# EasyEDA Pro project tumkibot1_audio_amplifier.eprj

# Schematic Schematic1
Board Name: Board1; Create Date: 2025-09-22; Page Name: P1; Project Name: tumkibot1_audio_amplifier; Schematic Name: Schematic1; Update Date: 2025-09-22; Company: EasyEDA.com; Page Size: A4; Version: V1.0
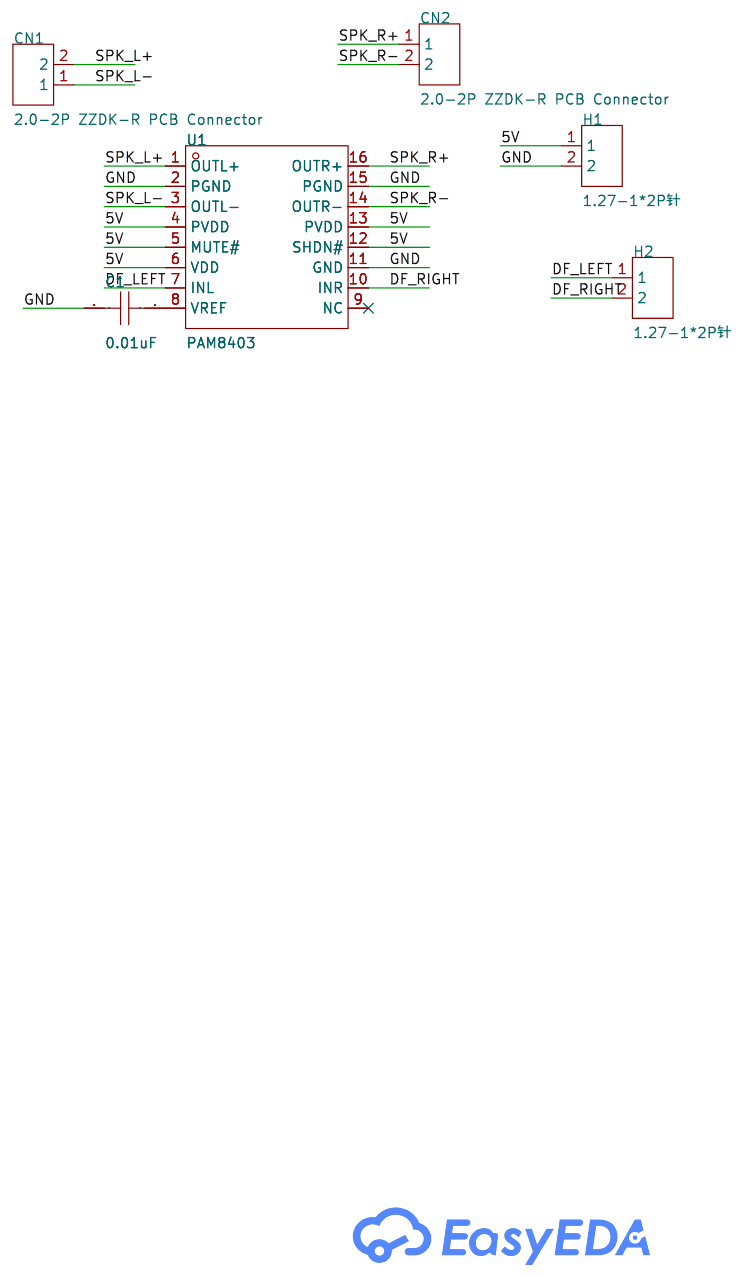
[diagram p0: schematic sheet]

## Parts
C1  100nF  [C0603]
CN1  2.0-2P ZZDK-R PCB Connector  [CONN-TH_2.0-2P-ZZDK-R-PCB-CONNECTOR]
CN2  2.0-2P ZZDK-R PCB Connector  [CONN-TH_2.0-2P-ZZDK-R-PCB-CONNECTOR]
H1  1.27-1*2P针  [HDR-TH_2P-P1.27-V-M]
H2  1.27-1*2P针  [HDR-TH_2P-P1.27-V-M]
U1  PAM8403  [SOP-16_L10.0-W3.9-P1.27-LS6.0-BL]

## Library data of the parts
C1 = CAP_0603: Supplier Footprint: 0603
CN1 CN2 = 2.0-2P ZZDK-R PCB Connector: LCSC Part Name: 1x2P 间距：2.0mm; Supplier Part: C49023773; Manufacturer: SHOU HAN(首韩); Supplier Footprint: 插件,P=2mm; JLCPCB Part Class: Extended Part; Datasheet: https://item.szlcsc.com/datasheet/2.0-2P%2520ZZDK-R%2520PCB%2520Connector/51384148.html; Supplier: LCSC
H1 H2 = 1.27-1*2P针: LCSC Part Name: 1x2P 间距:1.27mm 方针 直插; Supplier Part: C703015; Manufacturer: BOOMELE(博穆精密); Supplier Footprint: 插件,P=1.27mm; JLCPCB Part Class: Extended Part; Datasheet: https://item.szlcsc.com/datasheet/1.27-1*2P%25E9%2592%2588/738187.html; Supplier: LCSC; Pin Structure: 1x2P; Pitch: 1.27mm; Circluar Pins/Square Pins: Pin Header; Mounting Type: Through Hole; Number of Rows: 1; Number of Pins: 2P; Current Rating: 3A; Length of Mating Pin: 3mm; Insulation Height: 1.7mm; Length of End Connection Pin: 2.5mm; Contact Material: Brass; Operating Temperature: -55℃~+105℃; Color: Black
U1 = PAM8403: Supplier Part: C5122557; Manufacturer: Slkor(萨科微); Supplier Footprint: SOP-16; JLCPCB Part Class: Extended Part; Datasheet: https://item.szlcsc.com/datasheet/PAM8403/5713463.html; Supplier: LCSC; Class: Class D; Voltage - Supply: 2.2V~5.5V

## Nets
5V: H1.1 U1.4(PVDD) U1.5(MUTE#) U1.6(VDD) U1.12(SHDN#) U1.13(PVDD)
GND: C1.2 H1.2 U1.2(PGND) U1.11(GND) U1.15(PGND)
DF_LEFT: H2.1 U1.7(INL)
DF_RIGHT: H2.2 U1.10(INR)
SPK_L+: CN1.2 U1.1(OUTL+)
SPK_L-: CN1.1 U1.3(OUTL-)
SPK_R+: CN2.1 U1.16(OUTR+)
SPK_R-: CN2.2 U1.14(OUTR-)
$1N368: C1.1 U1.8(VREF)

Not connected (* = marked no-connect by the designer): U1 9(NC)*

# Board PCB1
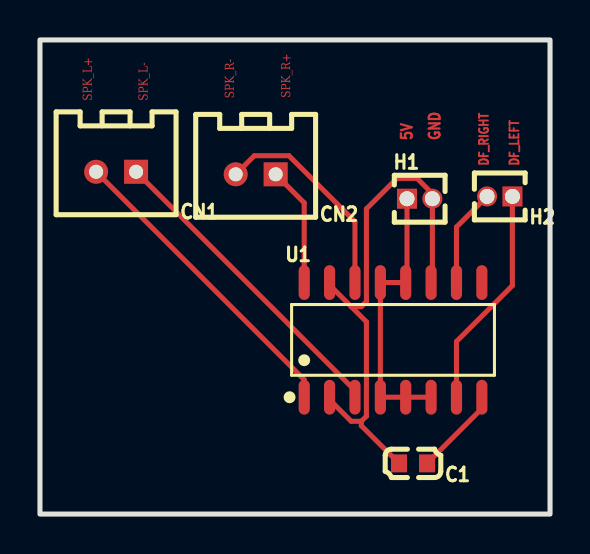
[diagram p1: board, top side]
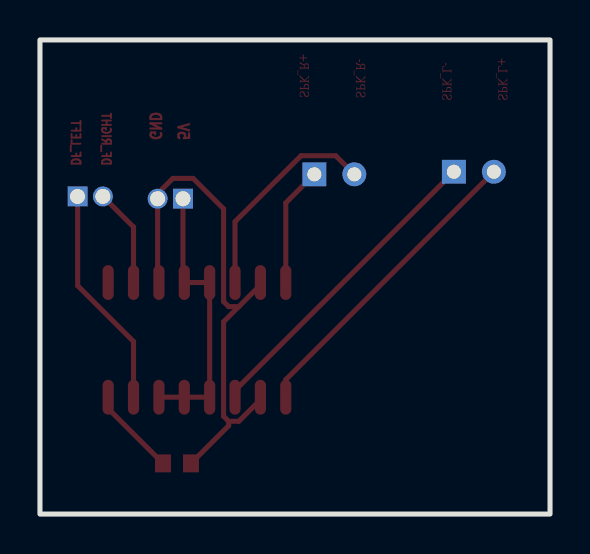
[diagram p2: board, bottom side, seen from below]

Outline 25.53 x 23.75 mm; copper layers: Top Layer, Bottom Layer. Coordinates in mm from the lower left corner of the outline.
Outline path: rectangle 0,23.75 25.53,0
Stack: Top Layer 0.035mm / Dielectric1 1.51mm FR4 er 4.5 / Bottom Layer 0.035mm

## Design rules (mm)
template: JLCPCB Capability(Two Layers Board)
spacing copperThickness1oz (default): track to track 0.102, other pairs 0.152 to 0.3
spacing copperThickness2oz: track to track 0.203, other pairs 0.152 to 0.3
track width copperThickness1oz (default): min 0.127, default 0.254, max 2.54
track width copperThickness2oz: min 0.203, default 0.254, max 2.54
differential pair differentialPair (default): width min 0.127, default 0.254, max 2.54; gap min 0.152, default 0.152
via viaSize (default): diameter min 0.5, default 0.61, max 10; hole min 0.3, default 0.305, max 6.3

## Placement (name value [footprint] x y rotation side)
C1  100nF  [C0603]  18.67 2.54 180 top
CN1  2.0-2P ZZDK-R PCB Connector  [CONN-TH_2.0-2P-ZZDK-R-PCB-CONNECTOR]  3.81 17.14 180 top
CN2  2.0-2P ZZDK-R PCB Connector  [CONN-TH_2.0-2P-ZZDK-R-PCB-CONNECTOR]  10.8 17.02 180 top
H1  1.27-1*2P针  [HDR-TH_2P-P1.27-V-M]  19 15.8 0 top
H2  1.27-1*2P针  [HDR-TH_2P-P1.27-V-M]  23.01 15.91 180 top
U1  PAM8403  [SOP-16_L10.0-W3.9-P1.27-LS6.0-BL]  17.67 8.72 0 top

## Footprints (pads in the part's own frame, mm; a bottom-side part is the same pattern mirrored in y, then rotated)
C0603
  rect 0.8x0.9 smd: 1(-0.7,0) 2(0.7,0)
CONN-TH_2.0-2P-ZZDK-R-PCB-CONNECTOR
  rect 1.2x1.2 hole 0.7: 1(-1,0)
  round 1.2 hole 0.7: 2(1,0)
HDR-TH_2P-P1.27-V-M
  rect 1x1 hole 0.75: 1(-0.635,0)
  round 1 hole 0.75: 2(0.635,0)
SOP-16_L10.0-W3.9-P1.27-LS6.0-BL
  oval 0.56x1.745 smd: 1(-4.445,-2.873) 2(-3.175,-2.873) 3(-1.905,-2.873) 4(-0.635,-2.873) 5(0.635,-2.873) 6(1.905,-2.873) 7(3.175,-2.873) 8(4.445,-2.873) 9(4.445,2.873) 10(3.175,2.873) 11(1.905,2.873) 12(0.635,2.873) 13(-0.635,2.873) 14(-1.905,2.873) 15(-3.175,2.873) 16(-4.445,2.873)

## Nets
As in the schematic.

Pads without a net: U1 9

## Routing (per net, layer and track width the routed paths; a pad name or vN(x,y) marks a point on that pad's centre or on a via; arc(x,y) is an arc through that point)
5V: length 13.8
  Top Layer w0.254: U1.6 U1.5 U1.4 U1.13 U1.12 18.37,11.66 18.37,15.8
GND: length 27.1
  Top Layer w0.254: 16.08,4.65 16.34,4.9 16.34,9.63 15.58,10.39 ; 16.08,4.65 15.58,4.65 14.56,5.66 14.56,5.79 U1.2 ; 16.08,4.65 16.08,4.43 17.97,2.54 ; 15.58,10.39 16.08,10.39 16.34,10.65 16.34,15.29 17.86,16.81 18.88,16.81 19.64,16.05 H1.2 19.64,11.66 U1.11 ; 15.58,10.39 14.49,11.47 U1.15
DF_LEFT: length 11.2
  Top Layer w0.254: U1.7 20.84,8.64 23.64,11.44 23.64,15.91
DF_RIGHT: length 4.9
  Top Layer w0.254: U1.10 20.84,14.38 H2.2
SPK_L+: length 15.6
  Top Layer w0.254: U1.1 13.22,6.73 CN1.2
SPK_L-: length 15.8
  Top Layer w0.254: CN1.1 15.76,6.19 U1.3
SPK_R+: length 6
  Top Layer w0.254: CN2.1 13.22,15.59 U1.16
SPK_R-: length 10.8
  Top Layer w0.254: U1.14 15.76,14.65 12.46,17.95 10.72,17.95 CN2.2
$1N368: length 4.4
  Top Layer w0.254: C1.1 22.11,5.29 U1.8

## Text on the board
Top Layer: DF_RIGHT | DF_LEFT | 5V | GND | SPK_L+ | SPK_L- | SPK_R- | SPK_R+
